# EAGLE design basic levitator (EAGLE 8.7.0)
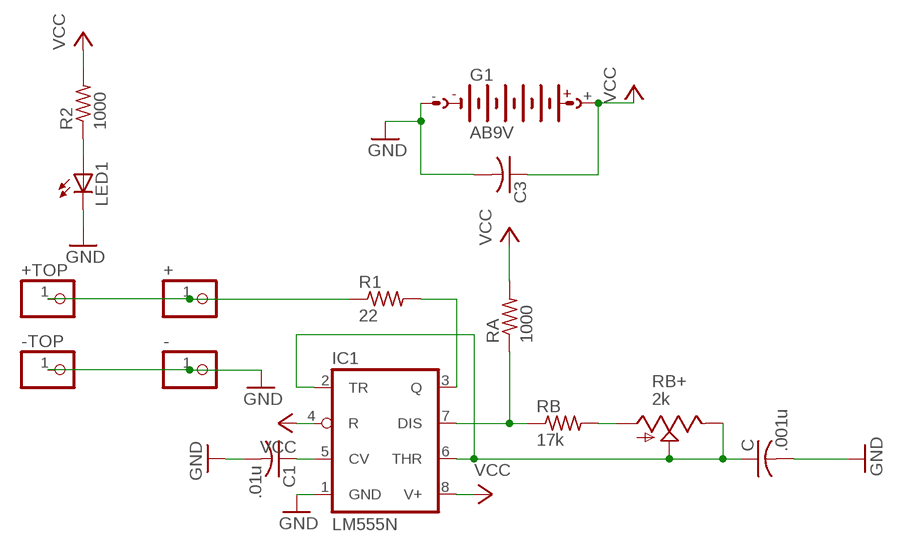
[diagram p0: schematic, sheet 1]

## Parts
+  PINHD-1X1  [1X01]
+TOP  PINHD-1X1  [1X01]
-  PINHD-1X1  [1X01]
-TOP  PINHD-1X1  [1X01]
C  .001u  C-US025-024X044  [C025-024X044]
C1  .01u  C-US025-025X050  [C025-025X050]
C3  C-US050-024X044  [C050-024X044]
G1  AB9V  [AB9V]
IC1  LM555N  [DIL08]
LED1  LED3MM  [LED3MM]
R1  22  R-US_0207/10  [0207/10]
R2  1000  R-US_0207/10  [0207/10]
RA  1000  R-US_0207/10  [0207/10]
RB  17k  R-US_0207/10  [0207/10]
RB+  2k  TRIM_US-CA6V  [CA6V]

## Nets
GND: -.1 -TOP.1 C1.2 C3.2 C.2 G1.- IC1.1(GND) LED1.K(C)
N$1: LED1.A R2.1
N$2: C1.1 IC1.5(CV)
N$3: C.1 IC1.2(TR) IC1.6(THR) RB+.E RB+.S
N$4: IC1.7(DIS) RA.1 RB.1
N$5: IC1.3(Q) R1.2
N$6: +.1 +TOP.1 R1.1
N$7: RB+.A RB.2
VCC: C3.1 G1.+ IC1.4(R) IC1.8(V+) R2.2 RA.2

## Library data of the parts
+ +TOP - -TOP = pinhead:PINHD-1X1: PIN HEADER
C C1 = rcl:C-US: CAPACITOR, American symbol
C3 = resistor:C-US: CAPACITOR, American symbol
G1 = battery:AB9V: 9-V BATTERY CLIP
IC1 = linear:*555: TIMER
LED1 = led:LED: LED OSRAM: - CHIPLED LG R971, LG N971, LY N971, LG Q971, LY Q971, LO R971, LY R971 LH N974, LH R974 LS Q976, LO Q976, LY Q976 LO Q996 - Hyper CHIPLED LW Q18S LB Q993, LB Q99A, LB R99A - SideLED LS A670, LO A670, LY A670, LG A670, LP A670 LB A673, LV A673, LT A673, LW A673 LH A674 LY A675 LS A676, LA A676, LO A676, LY A676, LW A676 LS A679, LY A679, LG A679 - Hyper Micro SIDELED® LS Y876, LA Y876, LO Y876, LY Y876 LT Y87S - SmartLED LW L88C, LW L88S LB L89C, LB L89S, LG L890 LS L89K, LO L89K, LY L89K LS L896, LA L896, LO L896, LY L896 - TOPLED LS T670, LO T670, LY T670, LG T670, LP T670 LSG T670, LSP T670, LSY T670, LOP T670, LYG T670 LG T671, LOG T671, LSG T671 LB T673, LV T673, LT T673, LW T673 LH T674 LS T676, LA T676, LO T676, LY T676, LB T676, LH T676, LSB T676, LW T676 LB T67C, LV T67C, LT T67C, LS T67K, LO T67K, LY T67K, LW E67C LS E67B, LA E67B, LO E67B, LY E67B, LB E67C, LV E67C, LT E67C LW T67C LS T679, LY T679, LG T679 LS T770, LO T770, LY T770, LG T770, LP T770 LB T773, LV T773, LT T773, LW T773 LH T774 LS E675, LA E675, LY E675, LS T675 LS T776, LA T776, LO T776, LY T776, LB T776 LHGB T686 LT T68C, LB T68C - Hyper Mini TOPLED® LB M676 - Mini TOPLED Santana® LG M470 LS M47K, LO M47K, LY M47K Source: http://www.osram.convergy.de LUXEON: - LUMILED® LXK2-PW12-R00, LXK2-PW12-S00, LXK2-PW14-U00, LXK2-PW14-V00 LXK2-PM12-R00, LXK2-PM12-S00, LXK2-PM14-U00 LXK2-PE12-Q00, LXK2-PE12-R00, LXK2-PE12-S00, LXK2-PE14-T00, LXK2-PE14-U00 LXK2-PB12-K00, LXK2-PB12-L00, LXK2-PB12-M00, LXK2-PB14-N00, LXK2-PB14-P00, LXK2-PB14-Q00 LXK2-PR12-L00, LXK2-PR12-M00, LXK2-PR14-Q00, LXK2-PR14-R00 LXK2-PD12-Q00, LXK2-PD12-R00, LXK2-PD12-S00 LXK2-PH12-R00, LXK2-PH12-S00 LXK2-PL12-P00, LXK2-PL12-Q00, LXK2-PL12-R00 Source: www.luxeon.com KINGBRIGHT: KA-3528ASYC Source: www.kingbright.com
R1 R2 RA RB = rcl:R-US_: RESISTOR, American symbol
RB+ = pot:TRIM_US-: POTENTIOMETER

## Board
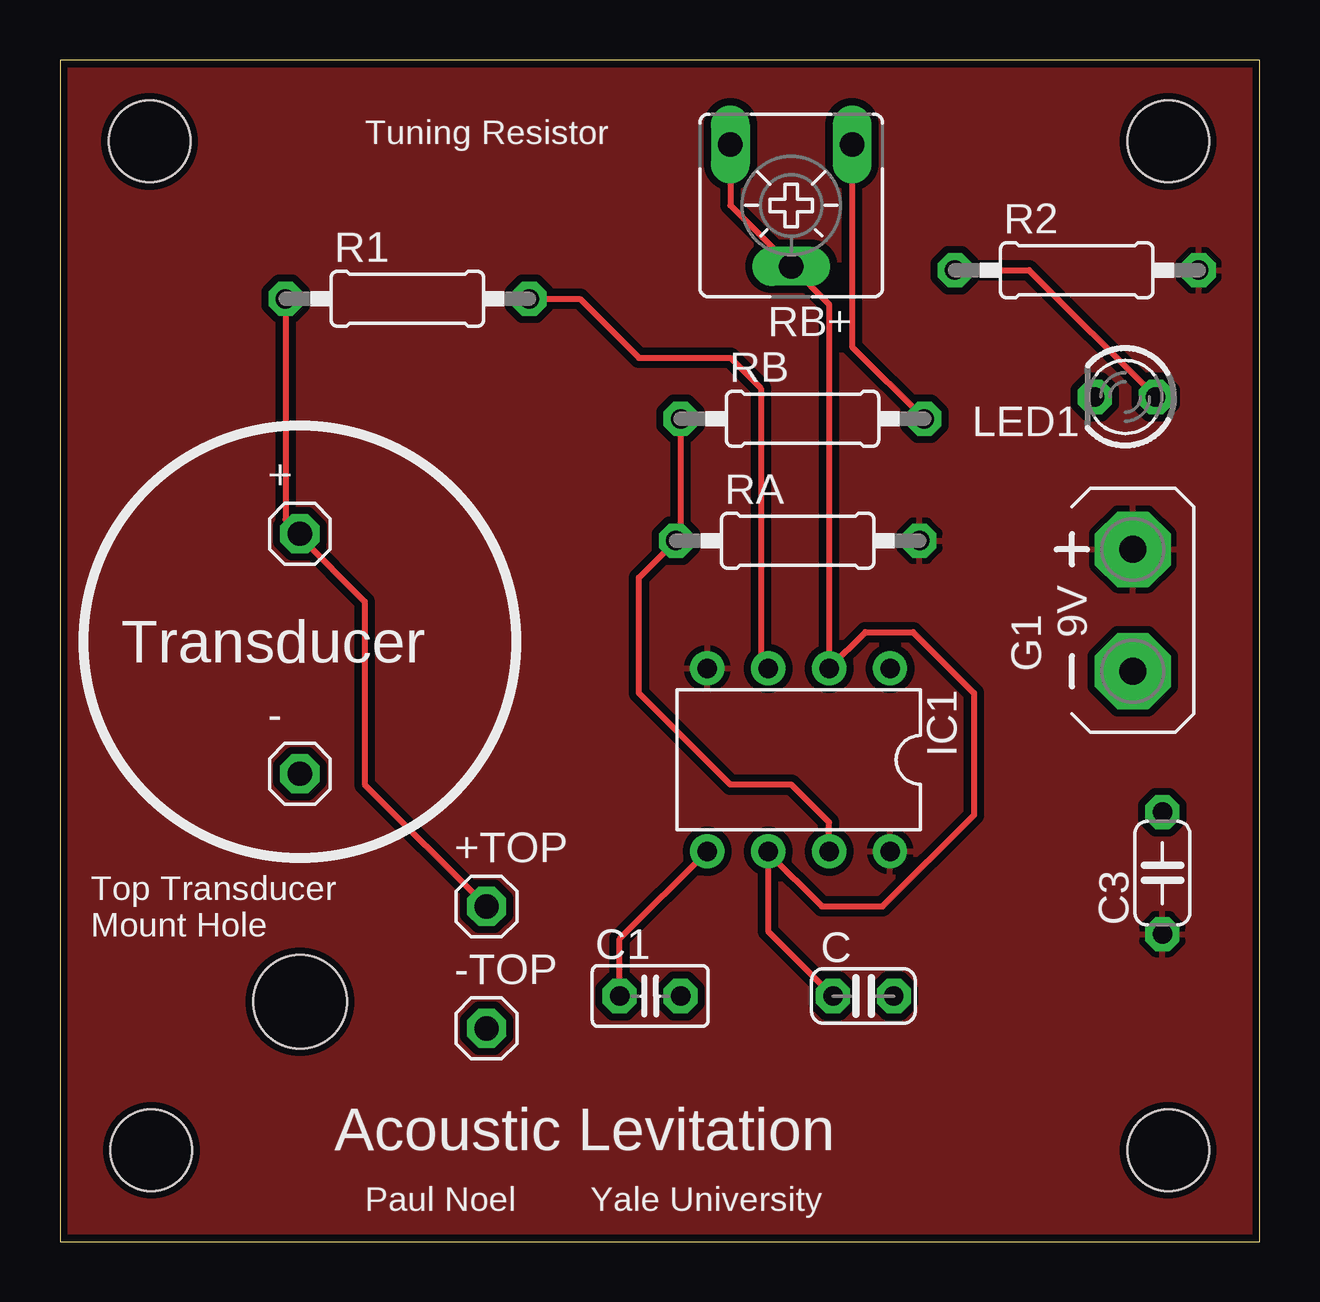
[diagram p1: board, top side]
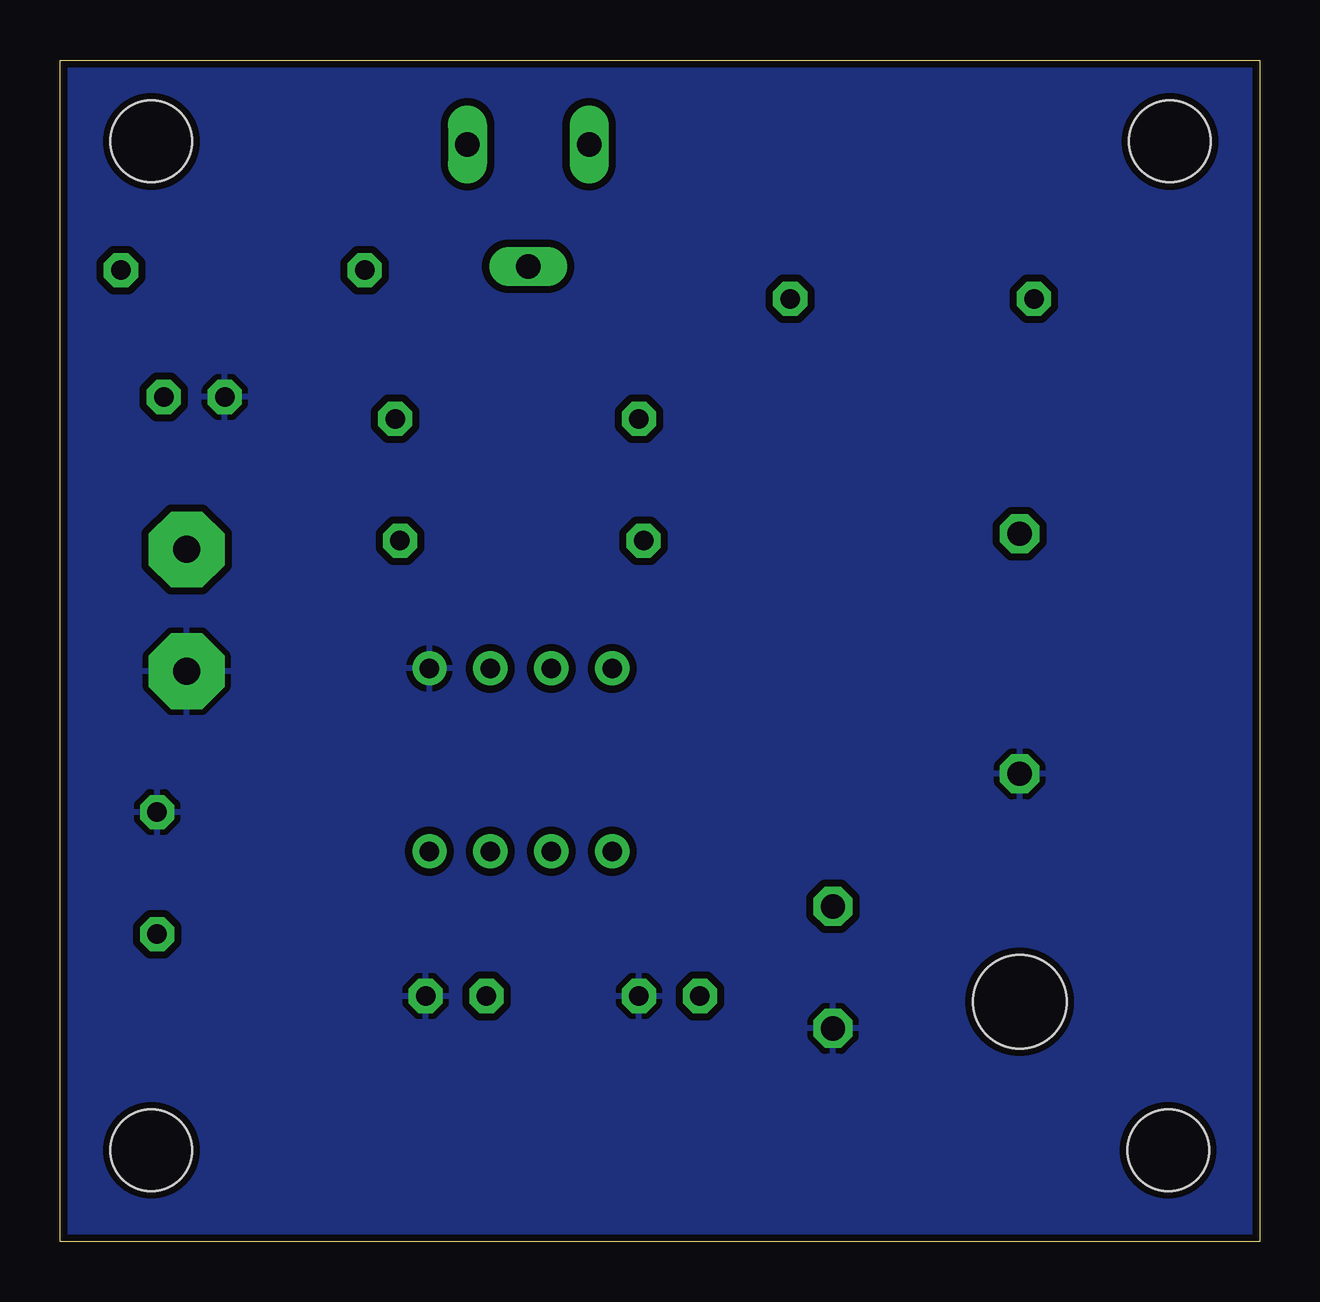
[diagram p2: board, bottom side, seen from below]

Size 50 x 49.24 mm. Coordinates in mm from the lower left corner, seen from the top.
Outline: 0,0 50,0 50,49.24 0,49.24 0,0
Copper layers (1*16): Top 0.035mm / dielectric 1.5mm / Bottom 0.035mm
Design rules "SparkFun": minimum track width 8mil, minimum drill 20mil, track to track 8mil, track to pad 8mil, pad to pad 8mil, via to via 8mil, smd to smd 8mil, copper to edge 8mil, drill to drill 8mil, minimum pad ring 12mil, minimum via ring 10mil, stop-mask expansion 4mil, vias tented up to drill 20mil, thermal gap 10mil
Holes 3.4 mm at 3.81,3.81 46.19,3.81 3.73,45.85 46.19,45.85
Holes 3.9 mm at 10,10

### Footprints (pad centres in the part's own frame; a part is rotated, then mirrored left to right if it is on the bottom)
1X01 = drill 1.016 octagon: 1 0,0
C025-024X044 = drill 0.813 octagon: 1 -1.27,0; 2 1.27,0
C025-025X050 = drill 0.813 octagon: 1 -1.27,0; 2 1.27,0
C050-024X044 = drill 0.813 octagon: 1 -2.54,0; 2 2.54,0
AB9V = drill 1.118 pad 3.15 octagon: + 0,2.54; - 0,-2.54
DIL08 = drill 0.813 pad 1.27: 1 -3.81,-3.81; 2 -1.27,-3.81; 3 1.27,-3.81; 4 3.81,-3.81; 5 3.81,3.81; 6 1.27,3.81; 7 -1.27,3.81; 8 -3.81,3.81
LED3MM = drill 0.813 octagon: A -1.27,0; K 1.27,0
0207/10 = drill 0.813 octagon: 1 -5.08,0; 2 5.08,0
CA6V = drill 1.016 long: A -2.54,-2.54; E 2.54,-2.54; S 0,2.54

### Placement (x,y rotation side)
+  10,29.5 0 top
+TOP  17.78,13.97 0 top
-  10,19.5 0 top
-TOP  17.78,8.89 0 top
C  33.49,10.24 0 top
C1  24.6,10.24 0 top
C3  45.95,15.36 90 top
G1  44.72,26.31 0 top
IC1  30.79,20.08 180 top
LED1  44.4,35.2 180 top
R1  14.48,39.29 0 top
R2  42.38,40.48 0 top
RA  30.75,29.21 0 top
RB  30.95,34.29 0 top
RB+  30.48,43.18 180 top

### Tracks (layer width: path | path; a pad name or v marks a point on that pad's centre or on a via)
GND
  pour Bottom (isolate 0.305): 0,49.53 50.8,49.53 50.8,0 0,0
N$1
  Top 0.254: R2.1 40.39,40.48 LED1.A
N$2
  Top 0.254: C1.1 23.33,12.62 IC1.5
N$3
  Top 0.254: C.1 29.52,12.94 IC1.6 29.52,16.2 31.75,13.97 34.29,13.97 38.1,17.78 38.1,22.86 35.56,25.4 33.57,25.4 IC1.2 32.06,39.06 RB+.S 27.94,43.18 RB+.E
N$4
  Top 0.254: IC1.7 32.06,17.47 30.48,19.05 27.94,19.05 24.13,22.86 24.13,27.67 RA.1 25.87,29.41 RB.1
N$5
  Top 0.254: R1.2 21.67,39.29 24.13,36.83 27.94,36.83 29.21,35.56 29.21,24.2 IC1.3
N$6
  Top 0.254: R1.1 9.4,30.1 +.1 10,29.37 12.7,26.67 12.7,19.05 +TOP.1
N$7
  Top 0.254: RB+.A 33.02,37.3 RB.2
VCC
  pour Top (isolate 0.305): 0,49.53 50.8,49.53 50.8,0 0,0

### Text on the board
tPlace: Tuning Resistor | Transducer | Top Transducer / Mount Hole | Acoustic Levitation | Paul Noel | Yale University